# Altium project ucaGps.PrjPcb
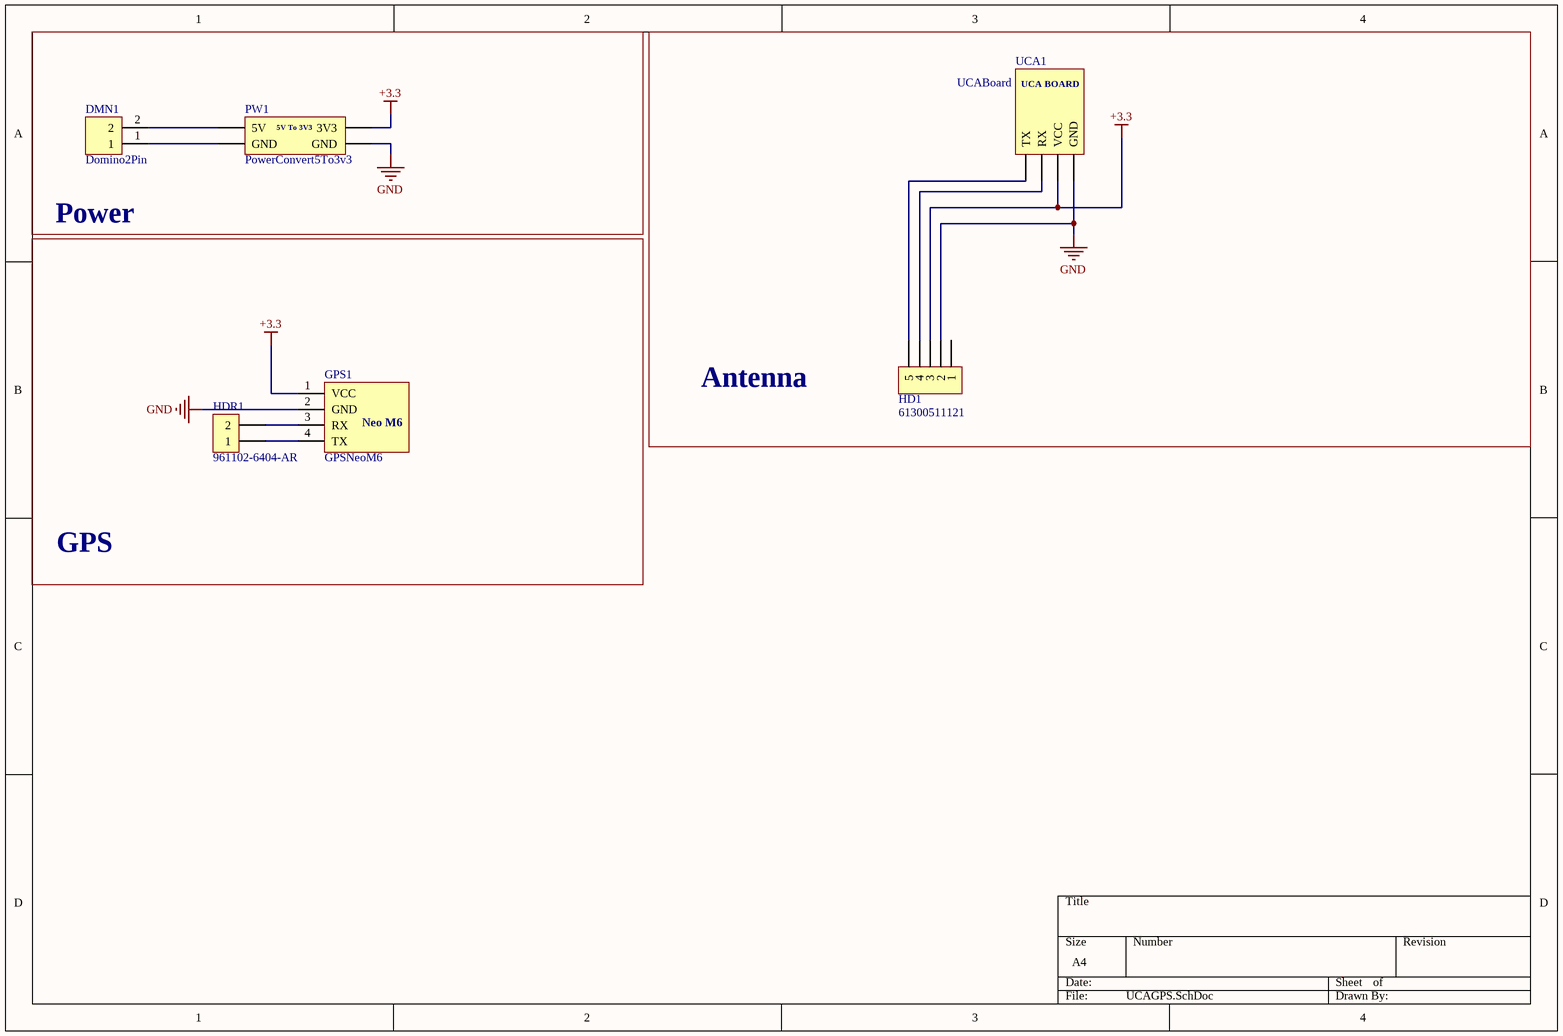
[diagram p0: UCAGPS.SchDoc]
1 sheet, 6 parts. Net scope: global (net labels, ports and power ports of the same name join across sheets).
Board file: UCAGPS.PcbDoc

## Sheet UCAGPS.SchDoc
size A4

### Parts
DMN1  Domino2Pin  [CONN-SIL2]
GPS1  GPSNeoM6  [GPSNEOM6]
HD1  61300511121  [HEADER]
HDR1  961102-6404-AR  [header2pin]
PW1  PowerConvert5To3v3  [PowerConvert5To3v3]
UCA1  UCABoard  [UCABOARD]

### Blocks framed on the sheet
Power: DMN1 PW1
Antenna: HD1 UCA1
GPS: GPS1 HDR1

### Nets
+3.3: GPS1.1(VCC) HD1.3 PW1.4(3V3) UCA1.3(VCC)
GND: GPS1.2(GND) HD1.2 PW1.3(GND) UCA1.4(GND)
NetDMN1_1: DMN1.1 PW1.2(GND)
NetDMN1_2: DMN1.2 PW1.1(5V)
NetGPS1_3: GPS1.3(RX) HDR1.2
NetGPS1_4: GPS1.4(TX) HDR1.1
NetHD1_4: HD1.4 UCA1.2(RX)
NetHD1_5: HD1.5 UCA1.1(TX)

Not connected (* = marked no-connect by the designer): HD1 1

### Notes on the sheet
- (in symbol GPSNeoM6) Neo M6
- (in symbol PowerConvert5To3v3) 5V To 3V3
- (in symbol UCABoard) UCA BOARD

### Library data of the parts
HD1 = 61300511121: WURTH ELEKTRONIK         61300511121            Board-To-Board Connector, Vertical, WR-PHD Series, Through Hole, Header, 5 Contacts, 2.54 mm; Manufacturer: Wurth Electronics; Number of Positions: 5; Gender: Male; Connector Type: Male Pin; Pitch: 0.1inch; Supplier 1: Digi-Key; Manufacturer Part Number: 61300511121; Stock 1: 24299; Pricing 1: 1 = 0.25000, 10 = 0.20900, 25 = 0.17400, 50 = 0.14500, 100 = 0.13200, 1000 = 0.12000 (USD); RoHS: Yes; Mount: Through Hole; Contact Plating: Gold; Contact Material: Copper; Color: Black; Number of Rows: 1; Packaging: Bulk; Termination: Solder; Number of Contacts: 5; Contact Mating Length: 0.236inch; REACH SVHC: Unknown; Lead Free: Lead Free; ComponentLink1URL: https://katalog.we-online.de/em/datasheet/6130xx11121.pdf?src-supplier=Digi-Key; ComponentLink1Description: https://katalog.we-online.de/em/datasheet/6130xx11121.pdf?src-supplier=Digi-Key; ComponentLink2URL: http://www.farnell.com/cad/1737268.pdf?src-supplier=Element14; ComponentLink2Description: http://www.farnell.com/cad/1737268.pdf?src-supplier=Element14; Supplier Part Number 1: 732-5318-ND
HDR1 = 961102-6404-AR: CONN HEADER VERT SGL 2POS GOLD; Manufacturer: 3M; Max Current Rating: 2A; Number of Positions: 2; Gender: Male; Connector Type: Male Pin; Pitch: 2.54mm; Contact Post Length: 3.3mm; Supplier 1: Digi-Key; Manufacturer Part Number: 961102-6404-AR; Stock 1: 58970; Pricing 1: 1 = 0.22000, 10 = 0.21000, 25 = 0.17920, 50 = 0.15680, 100 = 0.14560, 250 = 0.12880, 500 = 0.12320 (USD); RoHS: Yes; Mount: Through Hole; Contact Plating: Gold; Contact Material: Copper Alloy,Copper; Color: Black; Housing Color: Black; Housing Material: Thermoplastic; Min Operating Temperature: -25°C; Max Operating Temperature: 105°C; Number of Rows: 1; Package Quantity: 3000; Packaging: Bulk; Contact Gender: Male; Current Rating: 2A; Termination: Solder; Number of Contacts: 2; Orientation: Straight; Length: 5.08mm; Contact Mating Length: 0.22inch; Depth: 2.5mm; REACH SVHC: Unknown; ComponentLink1URL: https://datasheet.ciiva.com/14617/70237733-14617125.pdf?src-supplier=Allied+Electronics; ComponentLink1Description: https://datasheet.ciiva.com/14617/70237733-14617125.pdf?src-supplier=Allied+Electronics; ComponentLink2URL: https://datasheet.ciiva.com/731/ts2181-731431.pdf?src-supplier=Digi-Key; ComponentLink2Description: https://datasheet.ciiva.com/731/ts2181-731431.pdf?src-supplier=Digi-Key; ComponentLink3URL: https://datasheet.ciiva.com/7997/ts2181-7997272.pdf?src-supplier=Element14; ComponentLink3Description: https://datasheet.ciiva.com/7997/ts2181-7997272.pdf?src-supplier=Element14; ComponentLink4URL: https://datasheet.ciiva.com/5724/ts2181-5724889.pdf?src-supplier=Farnell; ComponentLink4Description: https://datasheet.ciiva.com/5724/ts2181-5724889.pdf?src-supplier=Farnell; ComponentLink5URL: https://datasheet.ciiva.com/46428/1794052-46428554.pdf?src-supplier=Element14; ComponentLink5Description: https://datasheet.ciiva.com/46428/1794052-46428554.pdf?src-supplier=Element14; Supplier Part Number 1: 3M9457-02-ND
PW1 = PowerConvert5To3v3: Convert 5 to 3.3